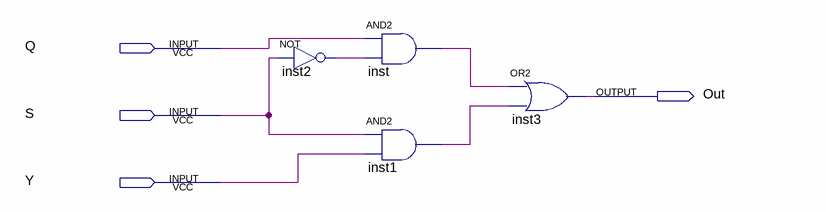
[diagram p0: schematic sheet]
// Quartus schematic 2x1mux.bdf as structural Verilog: 4 symbols, 4 pins
module \2x1mux  (
  input  Q,
  input  S,
  input  Y,
  output Out
);

  wire inst1_out, inst2_out, inst_out;

  not inst2 (inst2_out, S);
  and inst (inst_out, Q, inst2_out);
  and inst1 (inst1_out, S, Y);
  or inst3 (Out, inst_out, inst1_out);
endmodule
